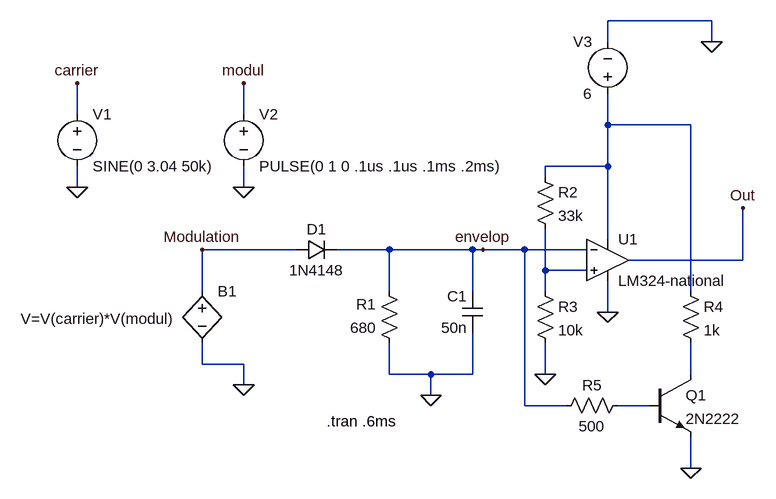
[diagram p0: schematic Demodulation-ASK-3.asc]
Demodulation-ASK-3.asc, the LTspice schematic file:
Version 4
SHEET 1 1048 680
WIRE 880 -368 720 -368
WIRE 720 -336 720 -368
WIRE 880 -336 880 -368
WIRE -96 -224 -96 -272
WIRE 160 -224 160 -272
WIRE 720 -208 720 -256
WIRE 848 -208 720 -208
WIRE 720 -144 720 -208
WIRE 720 -144 624 -144
WIRE 624 -128 624 -144
WIRE -96 -112 -96 -144
WIRE 160 -112 160 -144
WIRE 720 -32 720 -144
WIRE 240 -16 96 -16
WIRE 384 -16 304 -16
WIRE 512 -16 384 -16
WIRE 528 -16 512 -16
WIRE 592 -16 528 -16
WIRE 688 -16 592 -16
WIRE 928 0 928 -80
WIRE 928 0 752 0
WIRE 624 16 624 -48
WIRE 688 16 624 16
WIRE 96 48 96 -16
WIRE 384 48 384 -16
WIRE 512 48 512 -16
WIRE 624 48 624 16
WIRE 848 48 848 -208
WIRE 720 80 720 32
WIRE 96 160 96 128
WIRE 160 160 96 160
WIRE 384 176 384 128
WIRE 448 176 384 176
WIRE 512 176 512 112
WIRE 512 176 448 176
WIRE 624 176 624 128
WIRE 848 176 848 128
WIRE 160 192 160 160
WIRE 448 208 448 176
WIRE 592 224 592 -16
WIRE 656 224 592 224
WIRE 784 224 736 224
WIRE 848 320 848 272
FLAG 160 -112 0
FLAG -96 -112 0
FLAG 160 -272 modul
FLAG -96 -272 carrier
FLAG 528 -16 envelop
FLAG 720 80 0
FLAG 928 -80 Out
FLAG 624 176 0
FLAG 880 -336 0
FLAG 448 208 0
FLAG 160 192 0
FLAG 96 -16 Modulation
FLAG 848 320 0
DATAFLAG 96 48 "$"
SYMBOL bv 96 32 R0
WINDOW 3 -279 58 Left 2
SYMATTR Value V=V(carrier)*V(modul)
SYMATTR InstName B1
SYMBOL voltage 160 -240 R0
WINDOW 123 0 0 Left 0
WINDOW 39 0 0 Left 0
SYMATTR InstName V2
SYMATTR Value PULSE(0 1 0 .1us .1us .1ms .2ms)
SYMBOL voltage -96 -240 R0
WINDOW 123 0 0 Left 0
WINDOW 39 0 0 Left 0
SYMATTR InstName V1
SYMATTR Value SINE(0 3.04 50k)
SYMBOL cap 528 112 R180
WINDOW 0 24 56 Left 2
WINDOW 3 24 8 Left 2
SYMATTR InstName C1
SYMATTR Value 50n
SYMBOL res 400 144 R180
WINDOW 0 36 76 Left 2
WINDOW 3 36 40 Left 2
SYMATTR InstName R1
SYMATTR Value 680
SYMBOL diode 240 0 R270
WINDOW 0 32 32 VTop 2
WINDOW 3 0 32 VBottom 2
SYMATTR InstName D1
SYMATTR Value 1N4148
SYMBOL voltage 720 -240 R180
WINDOW 0 24 96 Left 2
WINDOW 3 24 16 Left 2
WINDOW 123 0 0 Left 0
WINDOW 39 0 0 Left 0
SYMATTR InstName V3
SYMATTR Value 6
SYMBOL res 608 -144 R0
SYMATTR InstName R2
SYMATTR Value 33k
SYMBOL res 608 32 R0
SYMATTR InstName R3
SYMATTR Value 10k
SYMBOL Opamps/LM324-national 720 -64 R0
SYMATTR InstName U1
SYMBOL npn2 784 176 R0
SYMATTR InstName Q1
SYMATTR Value 2N2222
SYMBOL res 832 32 R0
SYMATTR InstName R4
SYMATTR Value 1k
SYMBOL res 752 208 R90
WINDOW 0 0 56 VBottom 2
WINDOW 3 32 56 VTop 2
SYMATTR InstName R5
SYMATTR Value 500
TEXT 288 248 Left 2 !.tran .6ms

The netlist it stands for:
* Demodulation-ASK-3.asc
B1 Modulation 0 V=V(carrier)*V(modul)
V2 modul 0 PULSE(0 1 0 .1us .1us .1ms .2ms)
V1 carrier 0 SINE(0 3.04 50k)
C1 0 envelop 50n
R1 0 envelop 680
D1 Modulation envelop 1N4148
V3 N001 0 6
R2 N001 N002 33k
R3 N002 0 10k
XU1 N002 envelop N001 0 Out LM324-national  ; pins In+ In- V+ V- OUT
Q1 N003 N004 0 0 2N2222
R4 N001 N003 1k
R5 N004 envelop 500
.model D D
.lib standard.dio
.model NPN NPN
.model PNP PNP
.lib standard.bjt
.tran .6ms
.backanno
.end